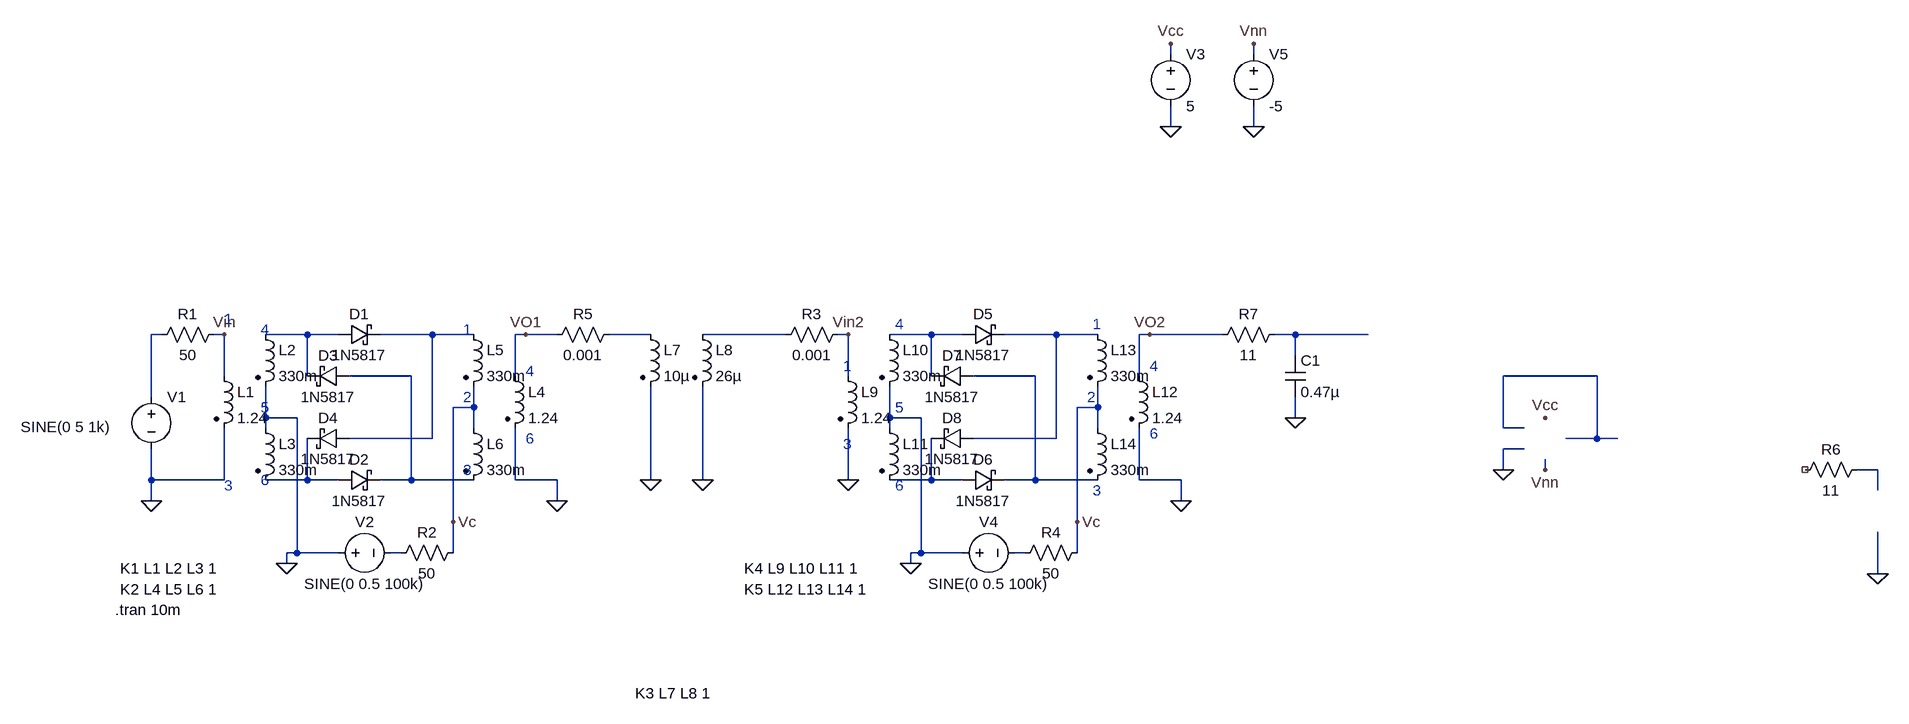
[diagram p0: schematic EmagsProj.asc]
EmagsProj.asc, the LTspice schematic file:
Version 4.1
SHEET 1 2828 680
WIRE 1664 -464 1664 -480
WIRE 1792 -464 1792 -480
WIRE 1664 -352 1664 -384
WIRE 1792 -352 1792 -384
WIRE 112 -32 96 -32
WIRE 208 -32 192 -32
WIRE 336 -32 272 -32
WIRE 384 -32 336 -32
WIRE 528 -32 448 -32
WIRE 592 -32 528 -32
WIRE 672 -32 656 -32
WIRE 720 -32 672 -32
WIRE 864 -32 800 -32
WIRE 1072 -32 944 -32
WIRE 1168 -32 1152 -32
WIRE 1296 -32 1232 -32
WIRE 1344 -32 1296 -32
WIRE 1488 -32 1408 -32
WIRE 1552 -32 1488 -32
WIRE 1632 -32 1616 -32
WIRE 1744 -32 1632 -32
WIRE 1856 -32 1824 -32
WIRE 1968 -32 1856 -32
WIRE 1856 0 1856 -32
WIRE 208 32 208 -32
WIRE 336 32 336 -32
WIRE 496 32 400 32
WIRE 656 32 656 -32
WIRE 1168 32 1168 -32
WIRE 1296 32 1296 -32
WIRE 1456 32 1360 32
WIRE 1616 32 1616 -32
WIRE 2320 32 2176 32
WIRE 96 64 96 -32
WIRE 592 80 592 48
WIRE 592 80 560 80
WIRE 1552 80 1552 48
WIRE 1552 80 1520 80
WIRE 272 96 272 48
WIRE 320 96 272 96
WIRE 1232 96 1232 48
WIRE 1280 96 1232 96
WIRE 1856 96 1856 64
WIRE 272 112 272 96
WIRE 592 112 592 80
WIRE 1232 112 1232 96
WIRE 1552 112 1552 80
WIRE 2176 112 2176 32
WIRE 2208 112 2176 112
WIRE 528 128 528 -32
WIRE 528 128 400 128
WIRE 1488 128 1488 -32
WIRE 1488 128 1360 128
WIRE 2320 128 2320 32
WIRE 2320 128 2272 128
WIRE 2352 128 2320 128
WIRE 2208 144 2176 144
WIRE 2176 176 2176 144
WIRE 2240 176 2240 160
WIRE 2752 176 2720 176
WIRE 96 192 96 144
WIRE 208 192 208 112
WIRE 208 192 96 192
WIRE 336 192 336 128
WIRE 336 192 272 192
WIRE 384 192 336 192
WIRE 496 192 496 32
WIRE 496 192 448 192
WIRE 592 192 496 192
WIRE 656 192 656 112
WIRE 720 192 656 192
WIRE 864 192 864 48
WIRE 944 192 944 48
WIRE 1168 192 1168 112
WIRE 1296 192 1296 128
WIRE 1296 192 1232 192
WIRE 1344 192 1296 192
WIRE 1456 192 1456 32
WIRE 1456 192 1408 192
WIRE 1552 192 1456 192
WIRE 1616 192 1616 112
WIRE 1680 192 1616 192
WIRE 2752 208 2752 176
WIRE 96 224 96 192
WIRE 720 224 720 192
WIRE 1680 224 1680 192
WIRE 560 256 560 80
WIRE 1520 256 1520 80
WIRE 320 304 320 96
WIRE 320 304 304 304
WIRE 384 304 320 304
WIRE 480 304 464 304
WIRE 560 304 560 256
WIRE 1280 304 1280 96
WIRE 1280 304 1264 304
WIRE 1344 304 1280 304
WIRE 1440 304 1424 304
WIRE 1520 304 1520 256
WIRE 304 320 304 304
WIRE 1264 320 1264 304
WIRE 2752 336 2752 272
FLAG 96 224 0
FLAG 720 224 0
FLAG 672 -32 VO1
FLAG 208 -32 Vin
FLAG 560 256 Vc
FLAG 304 320 0
FLAG 864 192 0
FLAG 944 192 0
FLAG 1680 224 0
FLAG 1632 -32 VO2
FLAG 1168 -32 Vin2
FLAG 1520 256 Vc
FLAG 1264 320 0
FLAG 1168 192 0
FLAG 2752 336 0
FLAG 1664 -352 0
FLAG 1664 -480 Vcc
FLAG 2240 96 Vcc
FLAG 2176 176 0
FLAG 1792 -352 0
FLAG 1792 -480 Vnn
FLAG 2240 176 Vnn
FLAG 1856 96 0
SYMBOL voltage 96 48 R0
WINDOW 3 -201 62 Left 2
WINDOW 123 0 0 Left 0
WINDOW 39 0 0 Left 0
SYMATTR Value SINE(0 5 1k)
SYMATTR InstName V1
SYMBOL voltage 368 304 R270
WINDOW 0 32 56 VTop 2
WINDOW 3 -32 56 VBottom 2
WINDOW 123 0 0 Left 0
WINDOW 39 0 0 Left 0
SYMATTR InstName V2
SYMATTR Value SINE(0 0.5 100k)
SYMBOL schottky 384 -16 R270
WINDOW 0 32 32 VTop 2
WINDOW 3 0 32 VBottom 2
SYMATTR InstName D1
SYMATTR Value 1N5817
SYMATTR Description Diode
SYMATTR Type diode
SYMBOL schottky 384 208 R270
WINDOW 0 32 32 VTop 2
WINDOW 3 0 32 VBottom 2
SYMATTR InstName D2
SYMATTR Value 1N5817
SYMATTR Description Diode
SYMATTR Type diode
SYMBOL schottky 400 16 R90
WINDOW 0 0 32 VBottom 2
WINDOW 3 32 32 VTop 2
SYMATTR InstName D3
SYMATTR Value 1N5817
SYMATTR Description Diode
SYMATTR Type diode
SYMBOL schottky 400 112 R90
WINDOW 0 0 32 VBottom 2
WINDOW 3 32 32 VTop 2
SYMATTR InstName D4
SYMATTR Value 1N5817
SYMATTR Description Diode
SYMATTR Type diode
SYMBOL ind2 192 16 R0
SYMATTR InstName L1
SYMATTR Value 1.24
SYMATTR Type ind
SYMBOL ind2 256 -48 R0
SYMATTR InstName L2
SYMATTR Value 330m
SYMATTR Type ind
SYMBOL ind2 576 -48 R0
SYMATTR InstName L5
SYMATTR Value 330m
SYMATTR Type ind
SYMBOL ind2 640 16 R0
SYMATTR InstName L4
SYMATTR Value 1.24
SYMATTR Type ind
SYMBOL ind2 256 96 R0
SYMATTR InstName L3
SYMATTR Value 330m
SYMATTR Type ind
SYMBOL ind2 576 96 R0
SYMATTR InstName L6
SYMATTR Value 330m
SYMATTR Type ind
SYMBOL res 576 288 R90
WINDOW 0 0 56 VBottom 2
WINDOW 3 32 56 VTop 2
SYMATTR InstName R2
SYMATTR Value 50
SYMBOL ind2 848 -48 R0
SYMATTR InstName L7
SYMATTR Value 10µ
SYMATTR Type ind
SYMBOL ind2 928 -48 R0
SYMATTR InstName L8
SYMATTR Value 26µ
SYMATTR Type ind
SYMBOL voltage 1328 304 R270
WINDOW 0 32 56 VTop 2
WINDOW 3 -32 56 VBottom 2
WINDOW 123 0 0 Left 0
WINDOW 39 0 0 Left 0
SYMATTR InstName V4
SYMATTR Value SINE(0 0.5 100k)
SYMBOL schottky 1344 -16 R270
WINDOW 0 32 32 VTop 2
WINDOW 3 0 32 VBottom 2
SYMATTR InstName D5
SYMATTR Value 1N5817
SYMATTR Description Diode
SYMATTR Type diode
SYMBOL schottky 1344 208 R270
WINDOW 0 32 32 VTop 2
WINDOW 3 0 32 VBottom 2
SYMATTR InstName D6
SYMATTR Value 1N5817
SYMATTR Description Diode
SYMATTR Type diode
SYMBOL schottky 1360 16 R90
WINDOW 0 0 32 VBottom 2
WINDOW 3 32 32 VTop 2
SYMATTR InstName D7
SYMATTR Value 1N5817
SYMATTR Description Diode
SYMATTR Type diode
SYMBOL schottky 1360 112 R90
WINDOW 0 0 32 VBottom 2
WINDOW 3 32 32 VTop 2
SYMATTR InstName D8
SYMATTR Value 1N5817
SYMATTR Description Diode
SYMATTR Type diode
SYMBOL ind2 1152 16 R0
SYMATTR InstName L9
SYMATTR Value 1.24
SYMATTR Type ind
SYMBOL ind2 1216 -48 R0
SYMATTR InstName L10
SYMATTR Value 330m
SYMATTR Type ind
SYMBOL ind2 1536 -48 R0
SYMATTR InstName L13
SYMATTR Value 330m
SYMATTR Type ind
SYMBOL ind2 1600 16 R0
SYMATTR InstName L12
SYMATTR Value 1.24
SYMATTR Type ind
SYMBOL ind2 1216 96 R0
SYMATTR InstName L11
SYMATTR Value 330m
SYMATTR Type ind
SYMBOL ind2 1536 96 R0
SYMATTR InstName L14
SYMATTR Value 330m
SYMATTR Type ind
SYMBOL res 1168 -48 R90
WINDOW 0 0 56 VBottom 2
WINDOW 3 32 56 VTop 2
SYMATTR InstName R3
SYMATTR Value 0.001
SYMBOL res 1536 288 R90
WINDOW 0 0 56 VBottom 2
WINDOW 3 32 56 VTop 2
SYMATTR InstName R4
SYMATTR Value 50
SYMBOL res 2736 160 R90
WINDOW 0 0 56 VBottom 2
WINDOW 3 32 56 VTop 2
SYMATTR InstName R6
SYMATTR Value 11
SYMBOL cap 1840 0 R0
SYMATTR InstName C1
SYMATTR Value 0.47µ
SYMBOL voltage 1664 -480 R0
WINDOW 123 0 0 Left 0
WINDOW 39 0 0 Left 0
SYMATTR InstName V3
SYMATTR Value 5
SYMBOL res 1840 -48 R90
WINDOW 0 0 56 VBottom 2
WINDOW 3 32 56 VTop 2
SYMATTR InstName R7
SYMATTR Value 11
SYMBOL voltage 1792 -480 R0
WINDOW 123 0 0 Left 0
WINDOW 39 0 0 Left 0
SYMATTR InstName V5
SYMATTR Value -5
SYMBOL res 208 -48 R90
WINDOW 0 0 56 VBottom 2
WINDOW 3 32 56 VTop 2
SYMATTR InstName R1
SYMATTR Value 50
SYMBOL res 816 -48 R90
WINDOW 0 0 56 VBottom 2
WINDOW 3 32 56 VTop 2
SYMATTR InstName R5
SYMATTR Value 0.001
TEXT 48 328 Left 2 !K1 L1 L2 L3 1
TEXT 48 360 Left 2 !K2 L4 L5 L6 1
TEXT 40 392 Left 2 !.tran 10m
TEXT 840 520 Left 2 !K3 L7 L8 1
TEXT 1008 328 Left 2 !K4 L9 L10 L11 1
TEXT 1008 360 Left 2 !K5 L12 L13 L14 1
TEXT 264 -40 Left 2 ;4
TEXT 264 80 Left 2 ;5
TEXT 264 192 Left 2 ;6
TEXT 208 -56 Left 2 ;1
TEXT 208 200 Left 2 ;3
TEXT 576 -40 Left 2 ;1
TEXT 576 64 Left 2 ;2
TEXT 576 176 Left 2 ;3
TEXT 672 24 Left 2 ;4
TEXT 672 128 Left 2 ;6
TEXT 1160 16 Left 2 ;1
TEXT 1160 136 Left 2 ;3
TEXT 1240 -48 Left 2 ;4
TEXT 1240 80 Left 2 ;5
TEXT 1240 200 Left 2 ;6
TEXT 1544 -48 Left 2 ;1
TEXT 1536 64 Left 2 ;2
TEXT 1544 208 Left 2 ;3
TEXT 1632 16 Left 2 ;4
TEXT 1632 120 Left 2 ;6

The netlist it stands for:
* EmagsProj.asc
V1 N001 0 SINE(0 5 1k)
V2 0 N015 SINE(0 0.5 100k)
D1 N002 N003 1N5817
D2 N013 N009 1N5817
D3 N009 N002 1N5817
D4 N003 N013 1N5817
L1 Vin 0 1.24
L2 N002 0 330m
L5 N003 Vc 330m
L4 VO1 0 1.24
L3 0 N013 330m
L6 Vc N009 330m
R2 Vc N015 50
L7 N004 0 10µ
L8 N005 0 26µ
V4 0 N016 SINE(0 0.5 100k)
D5 N006 N007 1N5817
D6 N014 N010 1N5817
D7 N010 N006 1N5817
D8 N007 N014 1N5817
L9 Vin2 0 1.24
L10 N006 0 330m
L13 N007 Vc 330m
L12 VO2 0 1.24
L11 0 N014 330m
L14 Vc N010 330m
R3 Vin2 N005 0.001
R4 Vc N016 50
R6 N012 NC_01 11
C1 N008 0 0.47µ
V3 Vcc 0 5
R7 N008 VO2 11
V5 Vnn 0 -5
R1 Vin N001 50
R5 N004 VO1 0.001
.model D D
.lib standard.dio
K1 L1 L2 L3 1
K2 L4 L5 L6 1
.tran 10m
K3 L7 L8 1
K4 L9 L10 L11 1
K5 L12 L13 L14 1
* 4
* 5
* 6
* 1
* 3
* 1
* 2
* 3
* 4
* 6
* 1
* 3
* 4
* 5
* 6
* 1
* 2
* 3
* 4
* 6
.backanno
.end